# Altium project disp7SegTester.PrjPcb
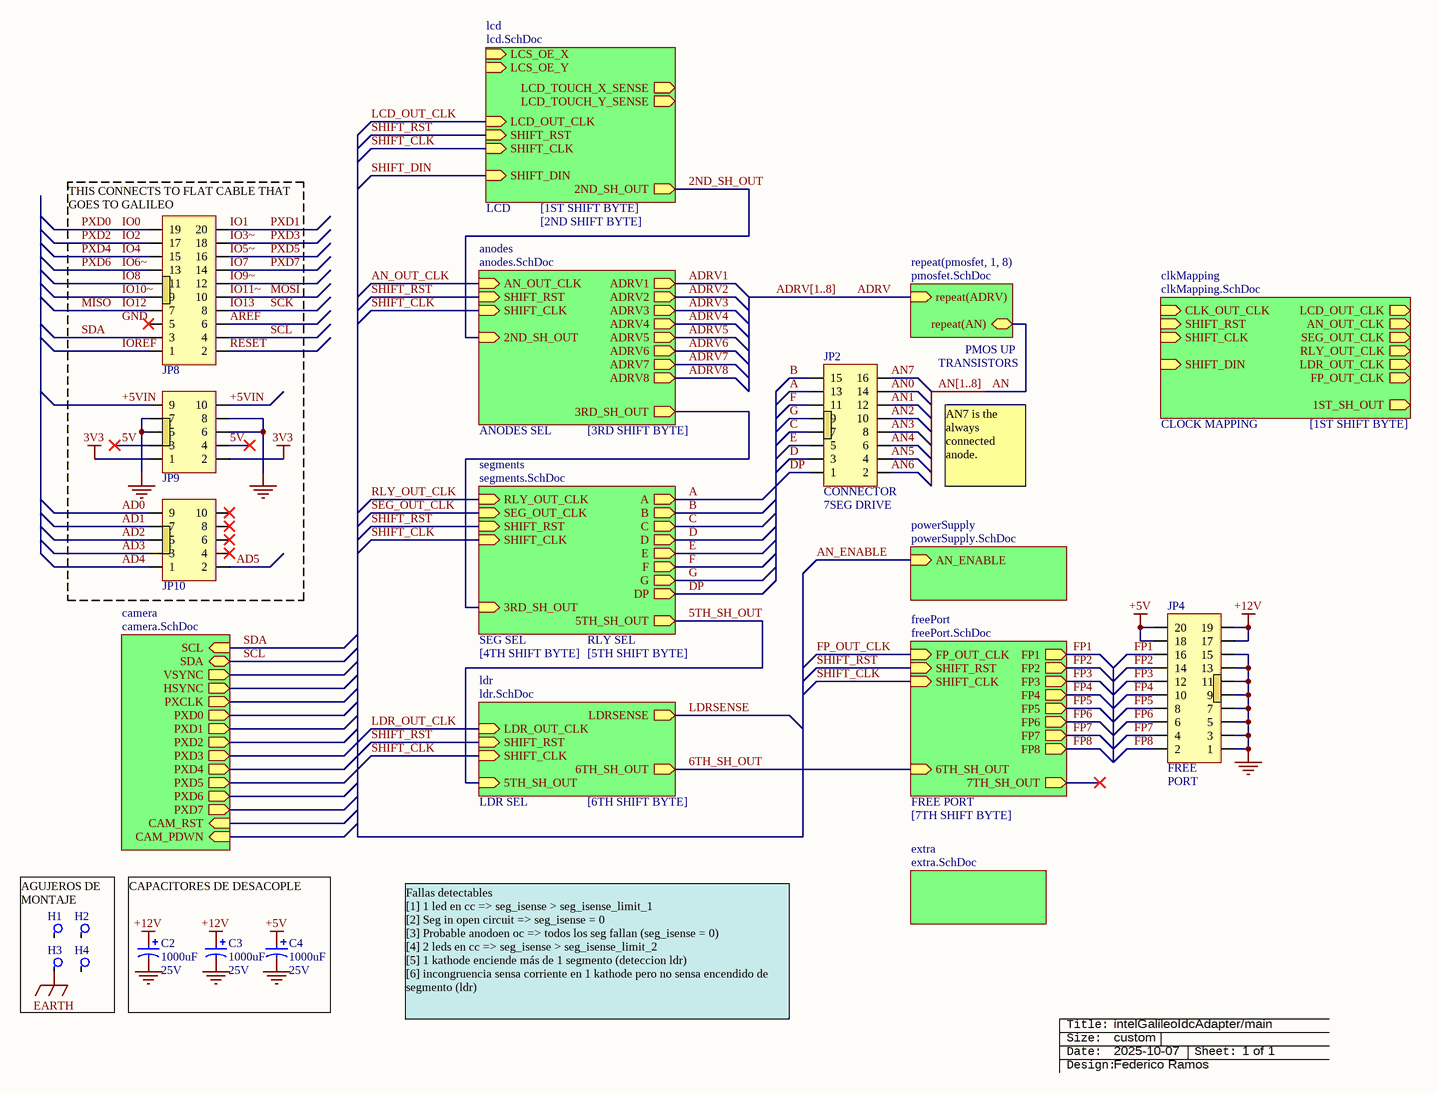
[diagram p0: disp7SegTester.SchDoc]
2 sheets, 45 parts. Net scope: hierarchical (ports join the sheet entries above them; power ports are global).
Board file: disp7SegTester.PcbDoc
Sheets:
  disp7SegTester.SchDoc
  relayNetwork.SchDoc

## Sheet disp7SegTester.SchDoc: DE:TMP:11:UC:EXPANDIDO
size 386 x 254 mm; Date: 21-07-2022; SheetNumber: 1; SheetTotal: 1; WebFGR: www.abebashop.com; VersionFGR: 20220721; PageSetup: Record=PageOptions|CenterHorizontal=True|CenterVertical=True|PrintScale=0.74|XCorrection=1.00|YCorrection=1.00|PrintKind=0|BorderSize=5000000|LeftOffset=0|BottomOffset=0|Orientation=2|PaperLength=1000|PaperWidth=1000|Scale=100|PaperSource=7|PrintQuality=-4|MediaType=1|DitherType=10|PaperKind=Letter|PrintScaleMode=1

### Parts
(Parts that share a designator on the sheet are numbered #1, #2 ... from top to bottom, then left to right.)
C2  value 1000uF  Voltaje: 25V  [C_EL_6-3X11]  (hidden comment: Cap Pol)
C3  value 1000uF  Voltaje: 25V  [C_EL_6-3X11]  (hidden comment: Cap Pol)
C4  value 1000uF  Voltaje: 25V  [C_EL_6-3X11]  (hidden comment: Cap Pol)
H1  Agujero de montaje  [agujero]  (value not drawn)
H2  Agujero de montaje  [agujero]  (value not drawn)
H3  Agujero de montaje  [agujero]  (value not drawn)
H4  Agujero de montaje  [agujero]  (value not drawn)
JP2  con: CONNECTOR  [idc8x2_90]  (hidden comment: IDC 8x2 90deg)
JP4  IDC 10x2  [idc10x2]  (value not drawn)
JP8  IDC 10x2 90deg  [idc10x2_90]  (value not drawn)
JP9  IDC 5x2  [IDC5x2_90]  (value not drawn)
JP10  IDC 5x2  [IDC5x2_90]  (value not drawn)
ROT?#1  Rotulo_empty  (value not drawn)  (graphical)

### Sub-sheets
anodes = anodes.SchDoc (file not in this document): 3RD_SH_OUT (out), AN_OUT_CLK (in), SHIFT_RST (in), SHIFT_CLK (in), 2ND_SH_OUT (in), ADRV1 (out), ADRV2 (out), ADRV3 (out), ADRV4 (out), ADRV5 (out), ADRV6 (out), ADRV7 (out), ADRV8 (out)  | : [3RD SHIFT BYTE]; : ANODES SEL
camera = camera.SchDoc (file not in this document): SCL (in), SDA (bidir), VSYNC (out), HSYNC (out), PXD0 (out), PXD1 (out), PXD2 (out), PXD3 (out), PXD4 (out), PXD5 (out), PXD6 (out), PXD7 (out), CAM_RST (in), CAM_PDWN (in), PXCLK (out)
clkMapping = clkMapping.SchDoc (file not in this document): 1ST_SH_OUT (out), CLK_OUT_CLK (in), SHIFT_RST (in), SHIFT_CLK (in), SHIFT_DIN (in), LCD_OUT_CLK (out), AN_OUT_CLK (out), SEG_OUT_CLK (out), RLY_OUT_CLK (out), LDR_OUT_CLK (out), FP_OUT_CLK (out)  | : [1ST SHIFT BYTE]; : CLOCK MAPPING
extra = extra.SchDoc (file not in this document): no entries
freePort = freePort.SchDoc (file not in this document): 7TH_SH_OUT (out), FP_OUT_CLK (in), SHIFT_RST (in), SHIFT_CLK (in), 6TH_SH_OUT (in), FP1 (out), FP2 (out), FP3 (out), FP4 (out), FP5 (out), FP6 (out), FP7 (out), FP8 (out)  | : [7TH SHIFT BYTE]; : FREE PORT
lcd = lcd.SchDoc (file not in this document): LCD_OUT_CLK (in), SHIFT_RST (in), SHIFT_CLK (in), SHIFT_DIN (in), 2ND_SH_OUT (out), LCS_OE_Y (in), LCS_OE_X (in), LCD_TOUCH_X_SENSE (out), LCD_TOUCH_Y_SENSE (out)  | : LCD; : [1ST SHIFT BYTE]; : [2ND SHIFT BYTE]
ldr = ldr.SchDoc (file not in this document): LDRSENSE (out), LDR_OUT_CLK (in), SHIFT_RST (in), SHIFT_CLK (in), 5TH_SH_OUT (in), 6TH_SH_OUT (out)  | : [6TH SHIFT BYTE]; : LDR SEL
powerSupply = powerSupply.SchDoc (file not in this document): AN_ENABLE (in)
repeat(pmosfet, 1, 8) = pmosfet.SchDoc (file not in this document): repeat(AN), repeat(ADRV) (in)  | : TRANSISTORS; : PMOS UP
segments = segments.SchDoc (file not in this document): 5TH_SH_OUT (out), RLY_OUT_CLK (in), SEG_OUT_CLK (in), SHIFT_RST (in), SHIFT_CLK (in), 3RD_SH_OUT (in), A (out), B (out), C (out), D (out), E (out), F (out), G (out), DP (out)  | : [5TH SHIFT BYTE]; : SEG SEL; : RLY SEL; : [4TH SHIFT BYTE]

### Nets
3V3: JP9.1 JP9.2
+5V: C4.1 JP4.18 JP4.20
+12V: C2.1 C3.1 JP4.17 JP4.19
EARTH: H3.1
GND: C2.2 C3.2 C4.2 JP4.1 JP4.3 JP4.5 JP4.7 JP4.9 JP4.11 JP4.13 JP4.15 JP9.5 JP9.6 JP9.7 JP9.8
2ND_SH_OUT: sheet anodes/2ND_SH_OUT, sheet lcd/2ND_SH_OUT
5TH_SH_OUT: sheet ldr/5TH_SH_OUT, sheet segments/5TH_SH_OUT
5V: JP9.3 JP9.4
6TH_SH_OUT: sheet ldr/6TH_SH_OUT, sheet freePort/6TH_SH_OUT
+5VIN: JP9.9 JP9.10
A: JP2.13 ; sheet segments/A
AD0: JP10.9
AD1: JP10.7
AD2: JP10.5
AD3: JP10.3
AD4: JP10.1
AD5: JP10.2
AN0: JP2.14
AN1: JP2.12
AN2: JP2.10
AN3: JP2.8
AN4: JP2.6
AN5: JP2.4
AN6: JP2.2
AN7: JP2.16
AREF: JP8.6
B: JP2.15 ; sheet segments/B
C: JP2.7 ; sheet segments/C
D: JP2.3 ; sheet segments/D
DP: JP2.1 ; sheet segments/DP
E: JP2.5 ; sheet segments/E
F: JP2.11 ; sheet segments/F
FP1: JP4.16 ; sheet freePort/FP1
FP2: JP4.14 ; sheet freePort/FP2
FP3: JP4.12 ; sheet freePort/FP3
FP4: JP4.10 ; sheet freePort/FP4
FP5: JP4.8 ; sheet freePort/FP5
FP6: JP4.6 ; sheet freePort/FP6
FP7: JP4.4 ; sheet freePort/FP7
FP8: JP4.2 ; sheet freePort/FP8
G: JP2.9 ; sheet segments/G
IO0: JP8.19  [also labelled PXD0]
IO1: JP8.20  [also labelled PXD1]
IO2: JP8.17  [also labelled PXD2]
IO3~: JP8.18  [also labelled PXD3]
IO4: JP8.15  [also labelled PXD4]
IO5~: JP8.16  [also labelled PXD5]
IO6~: JP8.13  [also labelled PXD6]
IO7: JP8.14  [also labelled PXD7]
IO8: JP8.11
IO9~: JP8.12
IO10~: JP8.9
IO11~: JP8.10  [also labelled MOSI]
IO12: JP8.7  [also labelled MISO]
IO13: JP8.8  [also labelled SCK]
IOREF: JP8.1
RESET: JP8.2
SCL: JP8.4 ; sheet camera/SDA
SDA: JP8.3 ; sheet camera/SCL
SHIFT_CLK: sheet ldr/SHIFT_CLK, sheet segments/SHIFT_CLK, sheet anodes/SHIFT_CLK, sheet freePort/SHIFT_CLK, sheet lcd/SHIFT_CLK
SHIFT_RST: sheet ldr/SHIFT_RST, sheet segments/SHIFT_RST, sheet anodes/SHIFT_RST, sheet freePort/SHIFT_RST, sheet lcd/SHIFT_RST
(unnamed): sheet segments/3RD_SH_OUT, sheet anodes/3RD_SH_OUT

Not connected (* = marked no-connect by the designer): H1 1; H2 1; H4 1; JP8 5*; JP10 4* 6* 8* 10*

### Buses and harness runs
bus ADRV[1..8]
bus AN[1..8]

### Notes on the sheet
- (near JP8) THIS CONNECTS TO FLAT CABLE THAT GOES TO GALILEO
- AN7 is the always connected anode.
- AGUJEROS DE MONTAJE
- CAPACITORES DE DESACOPLE
- Fallas detectables
  [1] 1 led en cc => seg_isense > seg_isense_limit_1
  [2] Seg in open circuit => seg_isense = 0
  [3] Probable anodoen oc => todos los seg fallan (seg_isense = 0)
  [4] 2 leds en cc => seg_isense > seg_isense_limit_2
  [5] 1 kathode enciende más de 1 segmento (deteccion ldr)
  [6] incongruencia sensa corriente en 1 kathode pero no sensa encendido de segmento (ldr)
- intelGalileoIdcAdapter/main
- custom
- 2025-10-07
- (near ROT?#1) 1 of 1
- Federico Ramos
- Labels drawn without touching a wire or pin: GND
- (in symbol IDC 5x2) AUX; OTRAS; SEÑALES
- (in symbol IDC 8x2 90deg) 7SEG DRIVE
- (in symbol IDC 10x2) FREE; PORT
- (in symbol Rotulo_empty) Title:; Size:; Date:; Sheet:; Design:

### Library data of the parts
C2-C4 = Cap Pol: Capacitor Electrolítico
JP2 = IDC 8x2 90deg: outout: OUTPUT; drv: DRIVE
ROT?#1 = Rotulo_empty: Rotulo [consolas]

## Sheet relayNetwork.SchDoc: DE:TMP:11:UC:EXPANDIDO
size 172 x 132 mm; Date: 21-07-2022; SheetNumber: 1; SheetTotal: 1; WebFGR: www.abebashop.com; VersionFGR: 20220721; PageSetup: Record=PageOptions|CenterHorizontal=True|CenterVertical=True|PrintScale=0.94|XCorrection=1.00|YCorrection=1.00|PrintKind=0|BorderSize=5000000|LeftOffset=0|BottomOffset=0|Orientation=2|PaperLength=1000|PaperWidth=1000|Scale=100|PaperSource=7|PrintQuality=-4|MediaType=1|DitherType=10|PaperKind=Letter|PrintScaleMode=1
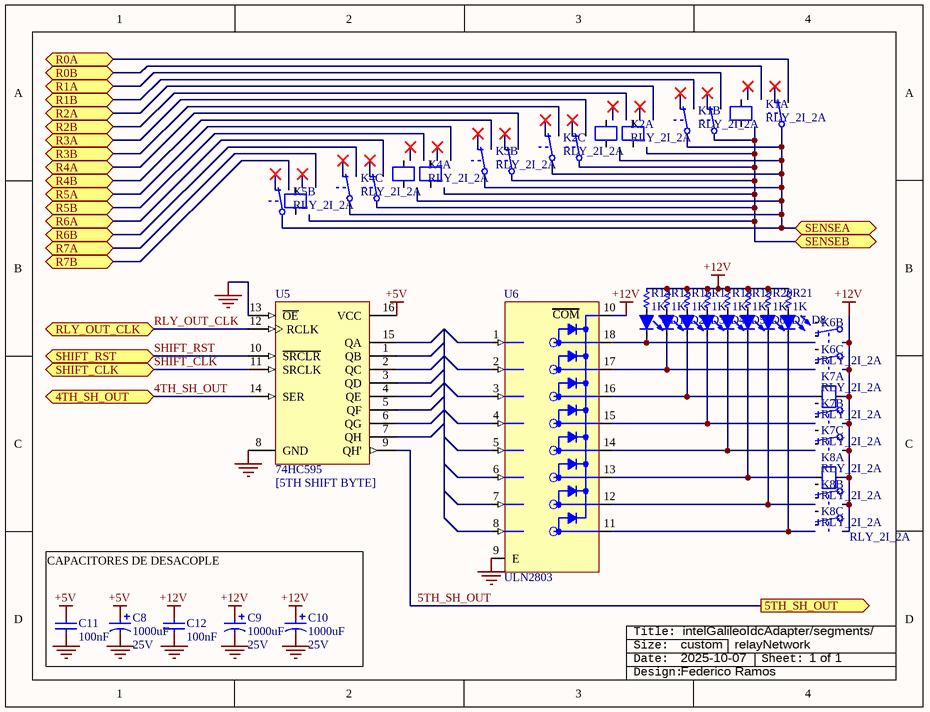
[diagram p1: relayNetwork.SchDoc]

### Parts
(Parts that share a designator on the sheet are numbered #1, #2 ... from top to bottom, then left to right.)
C8  value 1000uF  Voltaje: 25V  [C_EL_6-3X11]  (hidden comment: Cap Pol)
C9  value 1000uF  Voltaje: 25V  [C_EL_6-3X11]  (hidden comment: Cap Pol)
C10  value 1000uF  Voltaje: 25V  [C_EL_6-3X11]  (hidden comment: Cap Pol)
C11  value 100nF  [c1206]  (hidden comment: Cap)
C12  value 100nF  [c1206]  (hidden comment: Cap)
D1  Led 5mm Rojo Difuso  [LED5mm ROJO]  (value not drawn)
D2  Led 5mm Rojo Difuso  [LED5mm ROJO]  (value not drawn)
D3  Led 5mm Rojo Difuso  [LED5mm ROJO]  (value not drawn)
D4  Led 5mm Rojo Difuso  [LED5mm ROJO]  (value not drawn)
D5  Led 5mm Rojo Difuso  [LED5mm ROJO]  (value not drawn)
D6  Led 5mm Rojo Difuso  [LED5mm ROJO]  (value not drawn)
D7  Led 5mm Rojo Difuso  [LED5mm ROJO]  (value not drawn)
D8  Led 5mm Rojo Difuso  [LED5mm ROJO]  (value not drawn)
K1  RLY_2I_2A  [relay4]  (parts A,B,C of 3)
K2  RLY_2I_2A  [relay4]  (parts A,B,C of 3)
K3  RLY_2I_2A  [relay4]  (value not drawn)  (parts A,B,C of 3)
K4  RLY_2I_2A  [relay4]  (parts A,B,C of 3)
K5  RLY_2I_2A  [relay4]  (value not drawn)  (parts A,B,C of 3)
K6  RLY_2I_2A  [relay4]  (value not drawn)  (parts A,B,C of 3)
K7  RLY_2I_2A  [relay4]  (parts A,B,C of 3)
K8  RLY_2I_2A  [relay4]  (parts A,B,C of 3)
R14  value 1K  [R1206]  (hidden comment: Res)
R15  value 1K  [R1206]  (hidden comment: Res)
R16  value 1K  [R1206]  (hidden comment: Res)
R17  value 1K  [R1206]  (hidden comment: Res)
R18  value 1K  [R1206]  (hidden comment: Res)
R19  value 1K  [R1206]  (hidden comment: Res)
R20  value 1K  [R1206]  (hidden comment: Res)
R21  value 1K  [R1206]  (hidden comment: Res)
ROT?#2  Rotulo_empty_longTitle  (value not drawn)  (graphical)
U5  74HC595  [DIP16]
U6  ULN2803  [DIP18Z]

### Ports
4TH_SH_OUT, 5TH_SH_OUT (out), R0A, R0B, R1A, R1B, R2A, R2B, R3A, R3B, R4A, R4B, R5A, R5B, R6A, R6B, R7A, R7B, RLY_OUT_CLK, SENSEA, SENSEB, SHIFT_CLK, SHIFT_RST

### Nets
+5V: C8.1 C11.2 U5.16(VCC)
+12V: C9.1 C10.1 C12.2 K7.5 K8.5 R14.2 R15.2 R16.2 R17.2 R18.2 R19.2 R20.2 R21.2 U6.10(~{COM})
GND: C8.2 C9.2 C10.2 C11.1 C12.1 U5.8(GND) U5.13(~{OE}) U6.9(E)
4TH_SH_OUT: U5.14(SER) ; port 4TH_SH_OUT
5TH_SH_OUT: U5.9(QH') ; port 5TH_SH_OUT
RLY_OUT_CLK: U5.12(RCLK) ; port RLY_OUT_CLK
SHIFT_CLK: U5.11(SRCLK) ; port SHIFT_CLK
SHIFT_RST: U5.10(~{SRCLR}) ; port SHIFT_RST
NetD1_1: D1.1(A) R14.1
NetD1_2: D1.2(K) U6.18(~{C}1)
NetD2_1: D2.1(A) R15.1
NetD2_2: D2.2(K) U6.17(~{C}2)
NetD3_1: D3.1(A) R16.1
NetD3_2: D3.2(K) K7.4 U6.16(~{C}3)
NetD4_1: D4.1(A) R17.1
NetD4_2: D4.2(K) U6.15(~{C}4)
NetD5_1: D5.1(A) R18.1
NetD5_2: D5.2(K) U6.14(~{C}5)
NetD6_1: D6.1(A) R19.1
NetD6_2: D6.2(K) K8.4 U6.13(~{C}6)
NetD7_1: D7.1(A) R20.1
NetD7_2: D7.2(K) U6.12(~{C}7)
NetD8_1: D8.1(A) R21.1
NetD8_2: D8.2(K) U6.11(~{C}8)
NetK1_1: K1.1 K1.6 K2.6 K3.1 K4.6 K5.1 ; port SENSEA
NetK1_3: K1.3 ; port R1B
NetK1_8: K1.8 ; port R0A
NetK2_1: K2.1 K3.6 K4.1 K5.6 ; port SENSEB
NetK2_3: K2.3 ; port R1A
NetK2_8: K2.8 ; port R3B
NetK3_3: K3.3 ; port R4B
NetK3_8: K3.8 ; port R3A
NetK4_3: K4.3 ; port R4A
NetK4_8: K4.8 ; port R6B
NetK5_3: K5.3 ; port R7B
NetK5_8: K5.8 ; port R6A

Not connected (* = marked no-connect by the designer): K1 2* 4 5 7*; K2 2* 4 5 7*; K3 2* 4 5 7*; K4 2* 4 5 7*; K5 2* 4 5 7*; K6 1 2 3 4 5 6 7 8; K7 1 2 3 6 7 8; K8 1 2 3 6 7 8; U5 1(QB) 2(QC) 3(QD) 4(QE) 5(QF) 6(QG) 7(QH) 15(QA); U6 1(B1) 2(B2) 3(B3) 4(B4) 5(B5) 6(B6) 7(B7) 8(B8)

### Notes on the sheet
- CAPACITORES DE DESACOPLE
- custom
- 2025-10-07
- (near ROT?#2) intelGalileoIdcAdapter/segments/
- relayNetwork
- (near ROT?#2) 1 of 1
- Federico Ramos
- (in symbol 74HC595) [5TH SHIFT BYTE]
- (in symbol Rotulo_empty_longTitle) Title:; Size:; Date:; Sheet:; Design:
- (in symbol ULN2803) COM

### Library data of the parts
C8-C10 = Cap Pol: Capacitor Electrolítico; Price: ?
C11 C12 = Cap: Capacitor; Voltage: 50V; Price: 0.25; Technology: Ceramic
D1-D8 = Led 5mm Rojo Difuso: Codigo Ebay: NA; Dolares Ebay: 0.06
R14-R21 = Res: Resistencia; Power: 0.25W; Price: 0.036
ROT?#2 = Rotulo_empty_longTitle: Rotulo [consolas]
U5 = 74HC595: 8-Bit Shift Register with 3-State Output Registers
U6 = ULN2803: Darlington Transistor Array; Price: 1.40

## Nets that join several sheets
+5V: disp7SegTester (C4.1 JP4.18 JP4.20), relayNetwork (C8.1 C11.2 U5.16)
+12V: disp7SegTester (C2.1 C3.1 JP4.17 JP4.19), relayNetwork (14 pins)
GND: disp7SegTester (15 pins), relayNetwork (8 pins)